# EAGLE schematic LightManager (EAGLE 6.3)
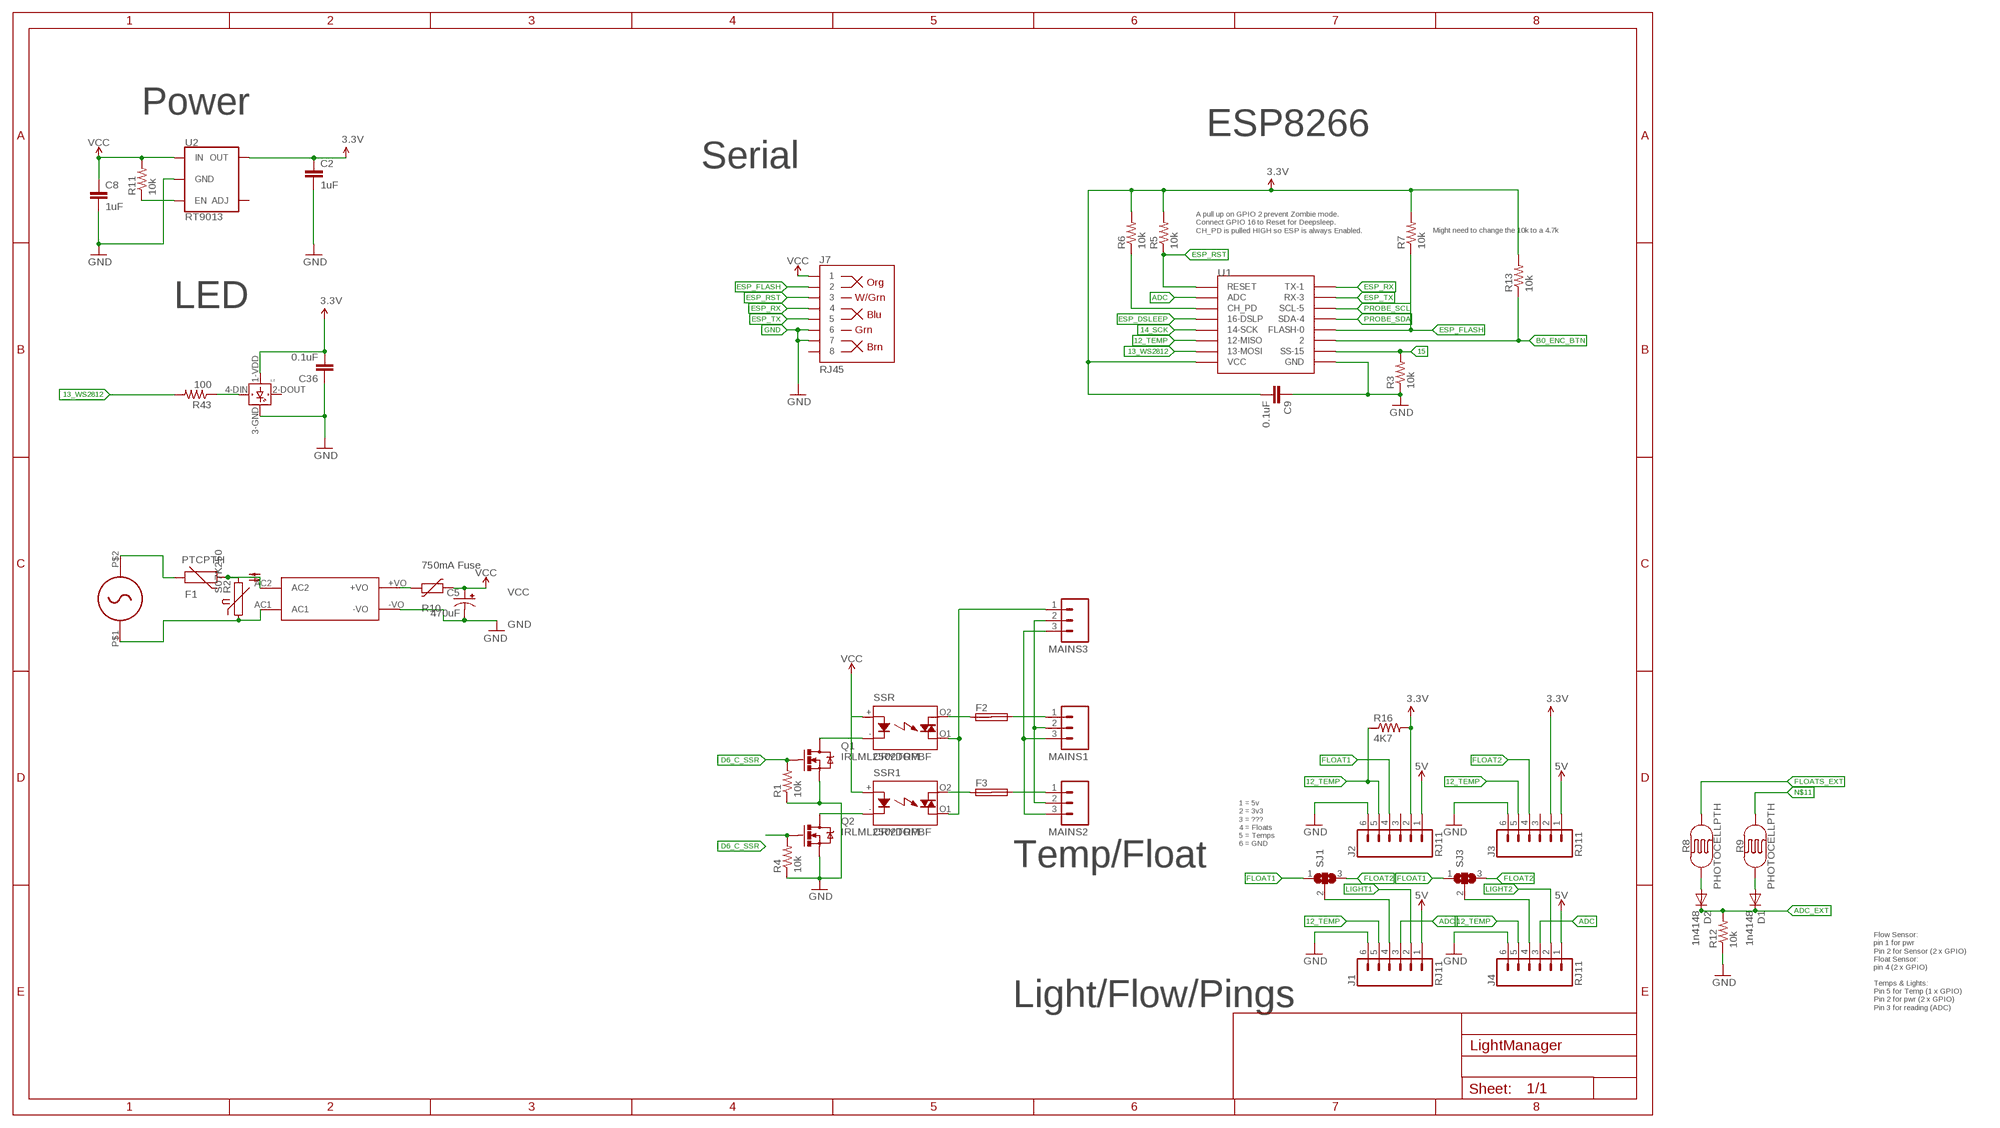
[diagram p0: schematic, sheet 1]

## Parts
C2  1uF  CAP0805  [0805]
C5  470uF  CAP_POLE  [PANASONIC_E]
C8  1uF  CAP0805  [0805]
C9  0.1uF  CAP0805  [0805]
C36  0.1uF  CAP0805  [0805]
D1  1n4148  DIODESOD  [SOD-323]
D2  1n4148  DIODESOD  [SOD-323]
F1  PTCPTH  [PTC]
F2  SHK20L  [SHK20L]
F3  SHK20L  [SHK20L]
J1  RJ11  RJ11-6  [RJ11-6]
J2  RJ11  RJ11-6  [RJ11-6]
J3  RJ11  RJ11-6  [RJ11-6]
J4  RJ11  RJ11-6  [RJ11-6]
J7  RJ45  RJ45-8  [RJ45-8]
L2  WS2812B  [WS2812B]
MAINS1  M03-SCREW-5MM  [SCREWTERMINAL-5MM-3]
MAINS2  M03-SCREW-5MM  [SCREWTERMINAL-5MM-3]
MAINS3  M03-SCREW-5MM  [SCREWTERMINAL-5MM-3]
Q1  IRLML2502TRPBF  MOSFET-NCHANNELSMD  [SOT23-3]
Q2  IRLML2502TRPBF  MOSFET-NCHANNELSMD  [SOT23-3]
R1  10k  RESISTOR0805  [0805]
R2  S07K250  [S07K250]
R3  10k  RESISTOR0805  [0805]
R4  10k  RESISTOR0805  [0805]
R5  10k  RESISTOR0805  [0805]
R6  10k  RESISTOR0805  [0805]
R7  10k  RESISTOR0805  [0805]
R8  PHOTOCELLPTH  [PHOTOCELL]
R9  PHOTOCELLPTH  [PHOTOCELL]
R10  750mA Fuse  VARISTORCN0805  [CT/CN0805]
R11  10k  RESISTOR0805  [0805]
R12  10k  RESISTOR0805  [0805]
R13  10k  RESISTOR0805  [0805]
R16  4K7  RESISTOR0805-RES  [0805]
R43  100  RESISTOR0805  [0805]
SJ1  SJ2W  [SJ_2]
SJ3  SJ2W  [SJ_2]
SSR  CRYDOM  AQG22224  [AQG]
SSR1  CRYDOM  AQG22224  [AQG]
U1  ESP12SMD  [ESP12-SMD]
U2  RT9013  AP2202-ADJ  [SOT23-5]
U$1  HLK-PM01  [HLK-PM01]
U$9  IEC320-C8  [IEC320-C8]

## Nets
3.3V: J2.2 J3.2 R16.2
5V: J1.1 J2.1 J3.1 J4.1
12_TEMP: J1.5 J2.5 J3.5 J4.5 R16.1 U1.GPIO12(12-MISO)
13_WS2812: R43.2 U1.GPIO13(13-MOSI)
14_SCK: U1.GPIO14(14-SCK)
15: R3.2 U1.GPIO15(SS-15)
ADC: J1.3 J4.3 U1.ADC
ADC_EXT: D1.1(C) D2.1(C) R12.2
B0_ENC_BTN: R13.1 U1.GPIO2
D6_C_SSR: Q1.1(G) Q2.1(G) R1.2 R4.2
ESP_3.3V: C2.1 C9.2 C36.2 L2.1-VDD(VDD) R5.2 R6.2 R7.2 R13.2 U1.VCC U2.5(OUT) ; supply symbol labelled 3.3V
ESP_DSLEEP: U1.GPIO16(16-DSLP)
ESP_FLASH: J7.2 R7.1 U1.GPIO0(FLASH-0)
ESP_GND: C9.1 C36.1 L2.3-GND(GND) R3.1 U1.GND ; supply symbol labelled GND
ESP_RST: J7.3 R5.1 U1.RESET
ESP_RX: J7.4 U1.TXD0(TX-1)
ESP_TX: J7.5 U1.RXD0(RX-3)
FLOAT1: J2.4 SJ1.1 SJ3.1
FLOAT2: J3.4 SJ1.3 SJ3.3
FLOATS_EXT: R8.2
GND: C2.2 C5.- C8.2 J1.6 J2.6 J3.6 J4.6 J7.6 J7.7 Q1.2(S) Q2.2(S) R1.1 R4.1 R12.1 U2.2(GND) U$1.-VO
LIGHT1: J1.2
LIGHT2: J4.2
MAIN_ACTIVE: F1.P$1 MAINS3.1 SSR1.O1(DS2) SSR.O1(DS2) U$9.P$2
MAIN_EARTH: MAINS1.3 MAINS2.3 MAINS3.3
MAIN_NETURAL: MAINS1.2 MAINS2.2 MAINS3.2 R2.1 U$1.AC1 U$9.P$1
N$1: R6.1 U1.CH_PD
N$2: D2.2(A) R8.1
N$3: Q1.3(D) SSR.-(K)
N$4: Q2.3(D) SSR1.-(K)
N$5: D1.2(A) R9.1
N$6: J1.4 SJ1.2
N$7: J4.4 SJ3.2
N$8: F1.P$2 R2.2 U$1.AC2
N$9: R10.2 U$1.+VO
N$10: R11.1 U2.3(EN)
N$11: R9.2
N$37: F3.1A SSR1.O2(DS1)
N$38: F2.1A SSR.O2(DS1)
N$44: F2.2A MAINS1.1
N$45: F3.2A MAINS2.1
N$74: L2.4-DIN(DIN) R43.1
PROBE_SCL: U1.GPIO5(SCL-5)
PROBE_SDA: U1.GPIO4(SDA-4)
VCC: C5.+ C8.1 J7.1 R10.1 R11.2 SSR1.+(A) SSR.+(A) U2.1(IN)
Unconnected: F2.1B F2.2B F3.1B F3.2B J2.3 J3.3 J7.8 L2.2-DOUT(DOUT) U2.4(ADJ)

## Notes on the sheet
- Power
- ESP8266
- Serial
- A pull up on GPIO 2 prevent Zombie mode.
  Connect GPIO 16 to Reset for Deepsleep.
  CH_PD is pulled HIGH so ESP is always Enabled.
- Might need to change the 10k to a 4.7k
- LED
- 1 = 5v
  2 = 3v3
  3 = ???
  4 = Floats
  5 = Temps
  6 = GND
- Temp/Float
- Light/Flow/Pings
- Flow Sensor:
  pin 1 for pwr
  Pin 2 for Sensor (2 x GPIO)
  Float Sensor:
  pin 4 (2 x GPIO)
  
  Temps & Lights:
  Pin 5 for Temp (1 x GPIO)
  Pin 2 for pwr (2 x GPIO)
  Pin 3 for reading (ADC)

## Library data of the parts
C2 C8 C9 C36 = SparkFun-Capacitors:CAP: Capacitor Standard 0603 ceramic capacitor, and 0.1" leaded capacitor.
C5 = SparkFun-Capacitors:CAP_POL: Capacitor Polarized These are standard SMD and PTH capacitors. Normally 10uF, 47uF, and 100uF in electrolytic and tantalum varieties. Always verify the external diameter of the through hole cap, it varies with capacity, voltage, and manufacturer. The EIA devices should be standard.
D1 D2 = SparkFun-DiscreteSemi:DIODE: Diode These are standard reverse protection diodes and small signal diodes. SMA package can handle up to about 1A. SOD-323 can handle about 200mA. What the SOD-323 package when ordering, there are some mfgs out there that are 5-pin packages.
F1 = SparkFun-PowerIC:PTC: Resettable Fuse PTC Resettable Fuse. Spark Fun Electronics SKU : COM-08357
F2 F3 = fuse:SHK20L: FUSE HOLDER 5 x 20 mm, SH contact, SHH1 Schukat, E1073 Buerklin; OC_FARNELL: unknown; OC_NEWARK: unknown
J1-J4 = SparkFun-Connectors:RJ11-6: RJ11 Jack - 6 pin Commonly found on CAT3 devices and some Microchip programmers. Here is the connector we sell at SparkFun: RJ11 6-Pin Connector <https://www.sparkfun.com/products/132> (PRT-00132) Datasheet <http://www.sparkfun.com/datasheets/Prototyping/Connectors/RJ11-Datasheet.pdf> It is used on this SparkFun product: SparkFun Weather Shield <https://www.sparkfun.com/products/12081> (DEV-12081) Weather Meters <https://www.sparkfun.com/products/8942> (SEN-08942); PROD_ID: CONN-08590; SF_ID: PRT-00132
J7 = SparkFun-Connectors:RJ45-8: RJ45 Jack - 8 pin Simple RJ45, 8-pin connection. Commonly used for Cat5, Cat5e, and Cat6 Ethernet cables. Here is the connector we sell at SparkFun: RJ45 8-Pin Connector <https://www.sparkfun.com/products/643> (PRT-00643) Datasheet <https://cdn.sparkfun.com/datasheets/Prototyping/04908.pdf> It is used on this SparkFun product: SparkFun RJ45 Breakout <https://www.sparkfun.com/products/716> (BOB-00716) Note, you may also be interested in the "MAGJACK" version of this. It is basically a RJ45 connector, but also has some status LEDs built into the connector housing. You can check that out in this library at the device named "MAGJACK.dev" and see these products online: RJ45 Ethernet MagJack-Compatible <https://www.sparkfun.com/products/8534> (PRT-08534) SparkFun RJ45 MagJack Breakout <https://www.sparkfun.com/products/13021> (BOB-13021); PROD_ID: CONN-08506; SF_ID: PRT-00643
L2 = adafruit:WS2812B
MAINS1-MAINS3 = SparkFun-Connectors:M03: Header 3 Standard 3-pin 0.1" header. Use with straight break away headers (SKU : PRT-00116), right angle break away headers (PRT-00553), swiss pins (PRT-00743), machine pins (PRT-00117), and female headers (PRT-00115). Molex polarized connector foot print use with SKU : PRT-08232 with associated crimp pins and housings.
Q1 Q2 = freetronics-master-v1.1:MOSFET-NCHANNEL
R1 R3-R7 R11-R13 R43 = LowPowerLab:RESISTOR: Resistor Basic schematic elements and footprints for 0603, 1206, and PTH resistors.
R2 = varistor:S07K250: VARISTOR
R8 R9 = SparkFun-Sensors:PHOTOCELL: Photocell (Photodetector, Photo Resistor, CdS) This is a very small light sensor. A photocell changes (also called a photodetector, photo resistor, CdS or photoconductive cell) resistance depending on the amount of light it is exposed to. These little sensors make great ambient light triggers (when light in the room turns on, do something). Datasheet <http://cdn.sparkfun.com/datasheets/Sensors/LightImaging/SEN-09088.pdf> SparkFun Products Mini Photocell <https://www.sparkfun.com/products/9088> (SEN-09088); PROD_ID: COMP-09129; SF_ID: SEN-09088
R10 = varistor:VARISTOR: VARISTOR
R16 = SparkFun-Resistors:RESISTOR: Resistor Basic schematic elements and footprints for 0603, 1206, and PTH resistors.
SJ1 SJ3 = jumper:SJ2W: SMD solder JUMPER
SSR SSR1 = 1_Skips:AQG*: SOLID STATE RELAY NAiS Zero-cross, Non zero-cross Source: http://www.mew-europe.com/.. en_ds_61611_0000.pdf; MPN: AQG22224; OC_FARNELL: unknown; OC_NEWARK: 11N2589
U1 = esp8266modules:ESP12: ESP8266 Wifi module 12
U2 = SparkFun-IC-Power:AP2202-ADJ: AP2202 Adjustable LDO Diodes Inc small, low-cost LDO 150mA, 13.2V, less than 200mV dropout; PROD_ID: VREG-12189; VALUE: AP2202-ADJ
U$1 = hlk-pm01:HLK-PM01
U$9 = 1_Skips:IEC320-C8: IEC320 C8 Connector Qualtek Electronics Corp. PPC DIVISION Part Number: 770W-X2/10 http://www.qualtekusa.com/Catalog/AC_Receptacles/pdfs/770wx210.pdf

## Net classes
1 power: width 0.381 mm, clearance 0.254 mm